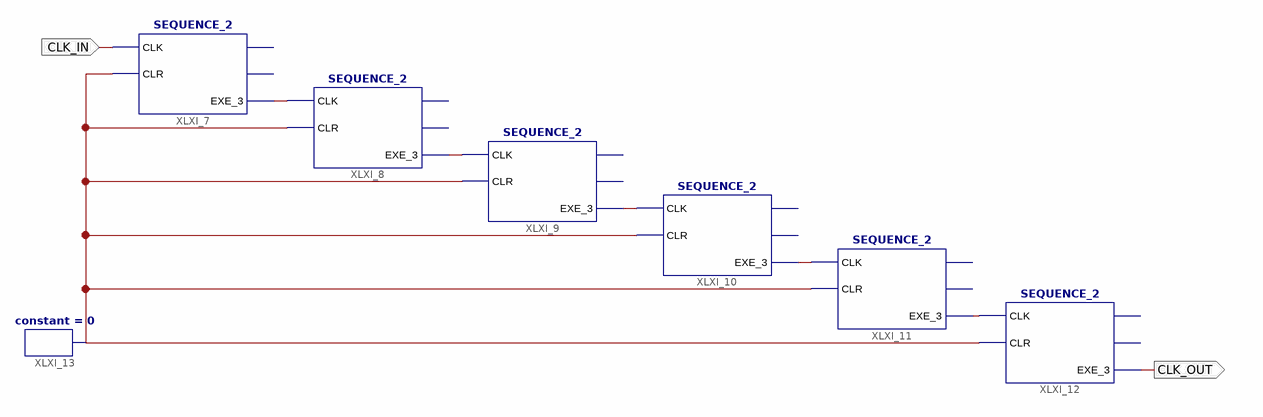
[diagram p0: schematic sheet 1]
// Xilinx ISE schematic FD_DELAY.sch (spartan3e) as structural Verilog: 7 symbols, 2 ports
module FD_DELAY (
  input  CLK_IN,
  output CLK_OUT
);

  wire XLXN_5, XLXN_6, XLXN_7, XLXN_8, XLXN_9, XLXN_16;

  SEQUENCE_2 XLXI_7 (.CLK(CLK_IN), .CLR(XLXN_9), .EXE_3(XLXN_5));  // open: EXE_1, EXE_2
  SEQUENCE_2 XLXI_8 (.CLK(XLXN_5), .CLR(XLXN_9), .EXE_3(XLXN_6));  // open: EXE_1, EXE_2
  SEQUENCE_2 XLXI_9 (.CLK(XLXN_6), .CLR(XLXN_9), .EXE_3(XLXN_7));  // open: EXE_1, EXE_2
  SEQUENCE_2 XLXI_10 (.CLK(XLXN_7), .CLR(XLXN_9), .EXE_3(XLXN_8));  // open: EXE_1, EXE_2
  SEQUENCE_2 XLXI_11 (.CLK(XLXN_8), .CLR(XLXN_9), .EXE_3(XLXN_16));  // open: EXE_1, EXE_2
  SEQUENCE_2 XLXI_12 (.CLK(XLXN_16), .CLR(XLXN_9), .EXE_3(CLK_OUT));  // open: EXE_1, EXE_2
  constant #(.CValue("0")) XLXI_13 (.O(XLXN_9));
endmodule
